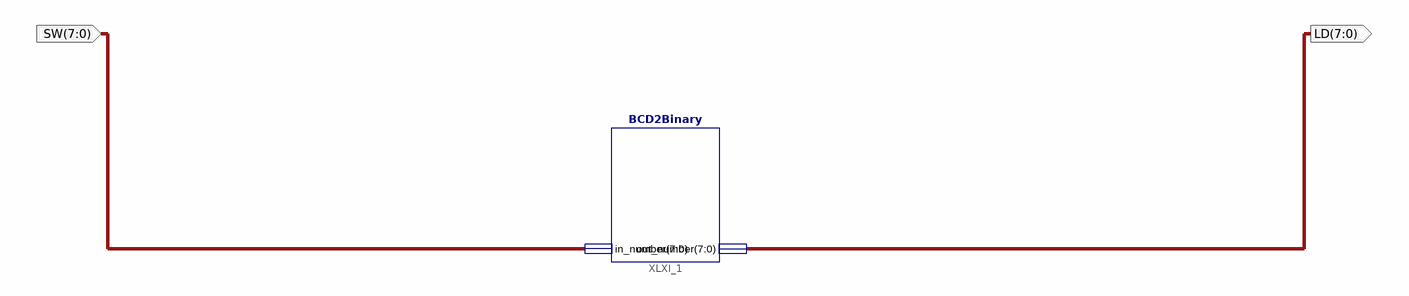
[diagram p0: schematic sheet 1]
// Xilinx ISE schematic Sch.sch (spartan3e) as structural Verilog: 1 symbols, 2 ports
module Sch (
  input  [7:0] SW,
  output [7:0] LD
);

  BCD2Binary XLXI_1 (.in_number(SW), .out_number(LD));
endmodule
